# EAGLE schematic untitled (EAGLE 8.5.0)
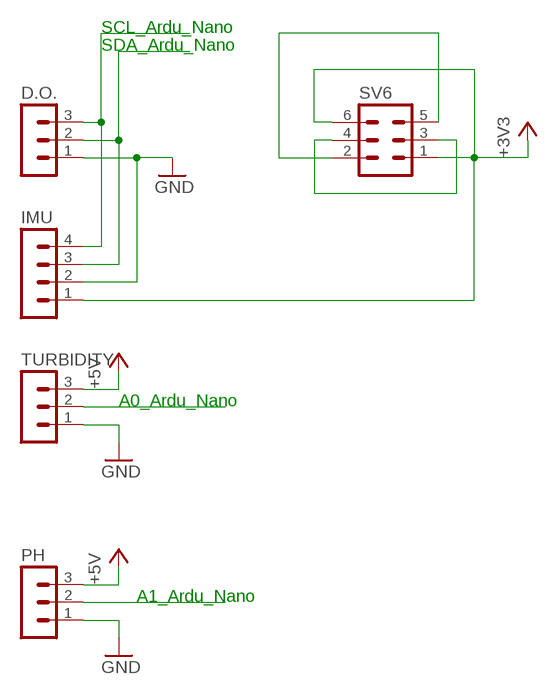
[diagram p0: schematic, sheet 1]

## Parts
D.O.  MA03-1  [MA03-1]
IMU  MA04-1  [MA04-1]
PH  MA03-1  [MA03-1]
SV6  MA03-2  [MA03-2]
TURBIDITY  MA03-1  [MA03-1]

## Nets
+3V3: IMU.1 SV6.1 SV6.6
+5V: PH.3 TURBIDITY.3
GND: D.O..1 IMU.2 PH.1 TURBIDITY.1
N$1: SV6.3 SV6.4
N$3: SV6.2 SV6.5
N$4: D.O..3 IMU.4
N$5: D.O..2 IMU.3
N$11: TURBIDITY.2
N$14: PH.2

## Notes on the sheet
- SCL_Ardu_Nano
- SDA_Ardu_Nano
- A0_Ardu_Nano
- A1_Ardu_Nano

## Library data of the parts
D.O. PH TURBIDITY = con-lstb:MA03-1: PIN HEADER; OC_FARNELL: unknown; OC_NEWARK: unknown
IMU = con-lstb:MA04-1: PIN HEADER; OC_FARNELL: unknown; OC_NEWARK: unknown
SV6 = con-lstb:MA03-2: PIN HEADER; OC_FARNELL: unknown; OC_NEWARK: unknown

## Module PORT1
Ports: 

### Library data of the parts